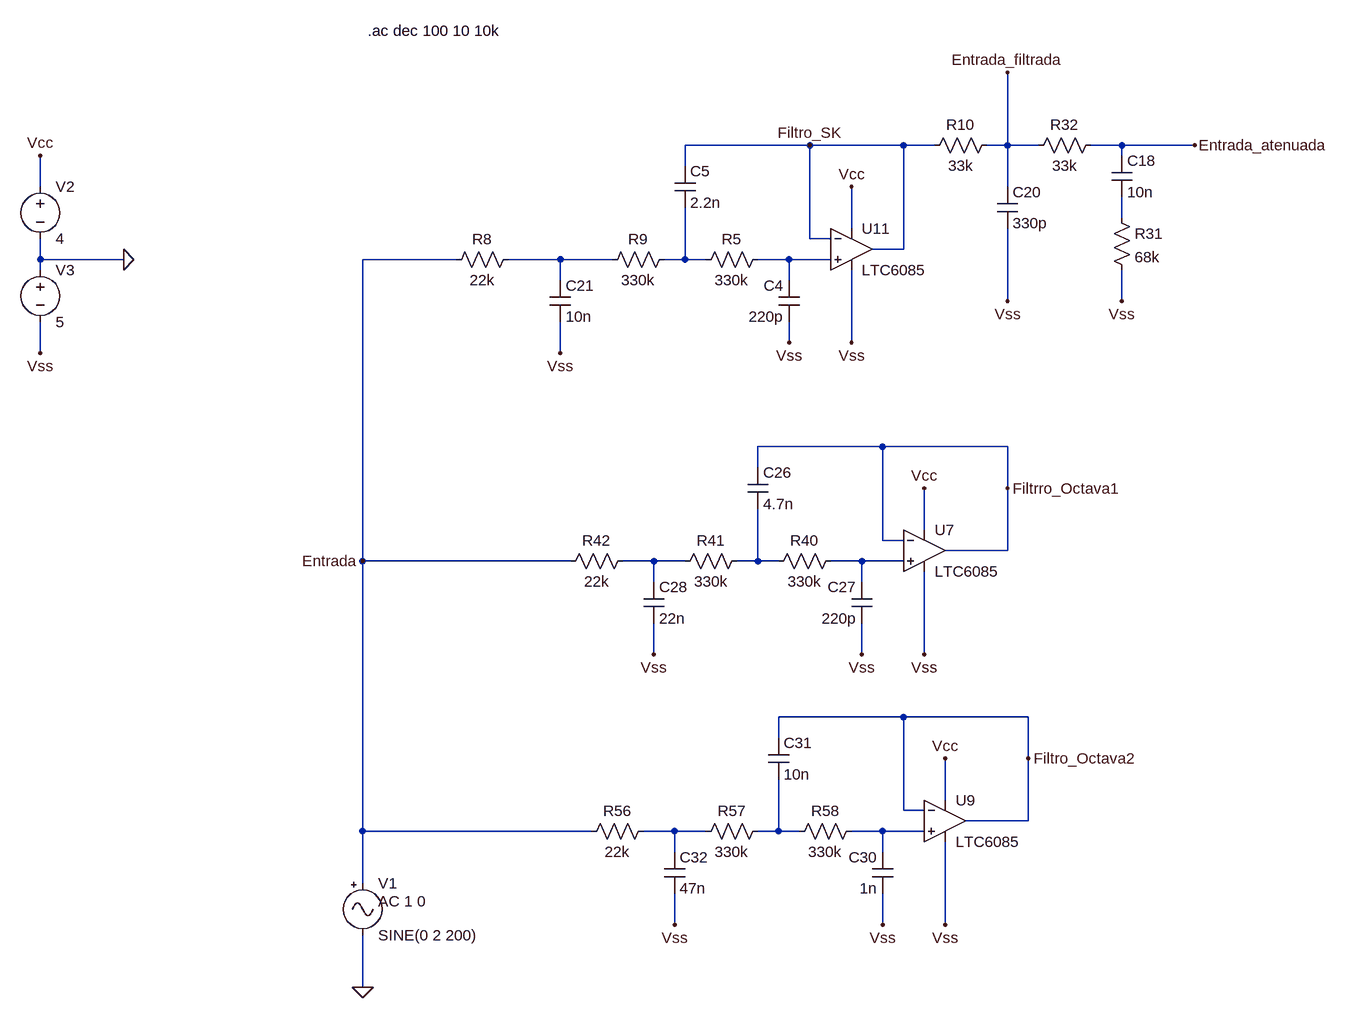
[diagram p0: schematic octavador OC2 - filtros.asc]
octavador OC2 - filtros.asc, the LTspice schematic file:
Version 4
SHEET 1 880 1368
WIRE -8992 -1648 -9184 -1648
WIRE -8848 -1648 -8992 -1648
WIRE -8800 -1648 -8848 -1648
WIRE -8688 -1648 -8688 -1760
WIRE -8688 -1648 -8720 -1648
WIRE -8640 -1648 -8688 -1648
WIRE -8512 -1648 -8560 -1648
WIRE -8400 -1648 -8512 -1648
WIRE -8512 -1632 -8512 -1648
WIRE -9184 -1616 -9184 -1648
WIRE -10176 -1584 -10176 -1632
WIRE -8688 -1584 -8688 -1648
WIRE -8512 -1536 -8512 -1568
WIRE -8928 -1520 -8928 -1584
WIRE -8992 -1504 -8992 -1648
WIRE -8960 -1504 -8992 -1504
WIRE -8848 -1488 -8848 -1648
WIRE -8848 -1488 -8896 -1488
WIRE -10176 -1472 -10176 -1504
WIRE -10048 -1472 -10176 -1472
WIRE -9536 -1472 -9680 -1472
WIRE -9376 -1472 -9456 -1472
WIRE -9296 -1472 -9376 -1472
WIRE -9184 -1472 -9184 -1552
WIRE -9184 -1472 -9216 -1472
WIRE -9152 -1472 -9184 -1472
WIRE -9024 -1472 -9072 -1472
WIRE -8960 -1472 -9024 -1472
WIRE -10176 -1456 -10176 -1472
WIRE -9376 -1440 -9376 -1472
WIRE -9024 -1440 -9024 -1472
WIRE -8688 -1408 -8688 -1520
WIRE -8512 -1408 -8512 -1456
WIRE -9024 -1344 -9024 -1376
WIRE -8928 -1344 -8928 -1456
WIRE -10176 -1328 -10176 -1376
WIRE -9376 -1328 -9376 -1376
WIRE -8880 -1184 -9072 -1184
WIRE -8688 -1184 -8880 -1184
WIRE -9072 -1152 -9072 -1184
WIRE -8688 -1120 -8688 -1184
WIRE -8816 -1056 -8816 -1120
WIRE -8880 -1040 -8880 -1184
WIRE -8848 -1040 -8880 -1040
WIRE -8688 -1024 -8688 -1120
WIRE -8688 -1024 -8784 -1024
WIRE -9680 -1008 -9680 -1472
WIRE -9360 -1008 -9680 -1008
WIRE -9232 -1008 -9280 -1008
WIRE -9184 -1008 -9232 -1008
WIRE -9072 -1008 -9072 -1088
WIRE -9072 -1008 -9104 -1008
WIRE -9040 -1008 -9072 -1008
WIRE -8912 -1008 -8960 -1008
WIRE -8848 -1008 -8912 -1008
WIRE -9232 -976 -9232 -1008
WIRE -8912 -976 -8912 -1008
WIRE -9232 -864 -9232 -912
WIRE -8912 -864 -8912 -912
WIRE -8816 -864 -8816 -992
WIRE -8848 -768 -9040 -768
WIRE -8656 -768 -8848 -768
WIRE -9040 -736 -9040 -768
WIRE -8656 -704 -8656 -768
WIRE -8784 -640 -8784 -704
WIRE -8848 -624 -8848 -768
WIRE -8816 -624 -8848 -624
WIRE -8656 -608 -8656 -704
WIRE -8656 -608 -8752 -608
WIRE -9680 -592 -9680 -1008
WIRE -9328 -592 -9680 -592
WIRE -9200 -592 -9248 -592
WIRE -9152 -592 -9200 -592
WIRE -9040 -592 -9040 -672
WIRE -9040 -592 -9072 -592
WIRE -9008 -592 -9040 -592
WIRE -8880 -592 -8928 -592
WIRE -8816 -592 -8880 -592
WIRE -9200 -560 -9200 -592
WIRE -8880 -560 -8880 -592
WIRE -9680 -512 -9680 -592
WIRE -9200 -448 -9200 -496
WIRE -8880 -448 -8880 -496
WIRE -8784 -448 -8784 -576
WIRE -9680 -352 -9680 -432
FLAG -10176 -1632 Vcc
FLAG -8816 -1120 Vcc
FLAG -8688 -1120 Filtrro_Octava1
FLAG -8784 -704 Vcc
FLAG -8656 -704 Filtro_Octava2
FLAG -8928 -1584 Vcc
FLAG -9680 -1008 Entrada
FLAG -10176 -1328 Vss
FLAG -10048 -1472 0
FLAG -9232 -864 Vss
FLAG -8912 -864 Vss
FLAG -8816 -864 Vss
FLAG -9200 -448 Vss
FLAG -8880 -448 Vss
FLAG -8784 -448 Vss
FLAG -8512 -1408 Vss
FLAG -8688 -1408 Vss
FLAG -9024 -1344 Vss
FLAG -8928 -1344 Vss
FLAG -9376 -1328 Vss
FLAG -9680 -352 0
FLAG -8400 -1648 Entrada_atenuada
FLAG -8992 -1648 Filtro_SK
FLAG -8688 -1760 Entrada_filtrada
SYMBOL Misc\\signal -9680 -528 R0
WINDOW 123 24 44 Left 2
WINDOW 39 0 0 Left 0
SYMATTR Value2 AC 1 0
SYMATTR InstName V1
SYMATTR Value SINE(0 2 200)
SYMBOL voltage -10176 -1600 R0
WINDOW 123 0 0 Left 0
WINDOW 39 0 0 Left 0
SYMATTR InstName V2
SYMATTR Value 4
SYMBOL voltage -10176 -1472 R0
WINDOW 123 0 0 Left 0
WINDOW 39 0 0 Left 0
SYMATTR InstName V3
SYMATTR Value 5
SYMBOL OpAmps\\LTC6085 -8816 -1024 R0
SYMATTR InstName U7
SYMBOL res -9376 -992 R270
WINDOW 0 32 56 VTop 2
WINDOW 3 0 56 VBottom 2
SYMATTR InstName R42
SYMATTR Value 22k
SYMBOL res -9200 -992 R270
WINDOW 0 32 56 VTop 2
WINDOW 3 0 56 VBottom 2
SYMATTR InstName R41
SYMATTR Value 330k
SYMBOL res -9056 -992 R270
WINDOW 0 32 56 VTop 2
WINDOW 3 0 56 VBottom 2
SYMATTR InstName R40
SYMATTR Value 330k
SYMBOL cap -9248 -976 R0
SYMATTR InstName C28
SYMATTR Value 22n
SYMBOL cap -9088 -1152 R0
SYMATTR InstName C26
SYMATTR Value 4.7n
SYMBOL cap -8896 -912 R180
WINDOW 0 24 56 Left 2
WINDOW 3 24 8 Left 2
SYMATTR InstName C27
SYMATTR Value 220p
SYMBOL OpAmps\\LTC6085 -8784 -608 R0
SYMATTR InstName U9
SYMBOL res -9344 -576 R270
WINDOW 0 32 56 VTop 2
WINDOW 3 0 56 VBottom 2
SYMATTR InstName R56
SYMATTR Value 22k
SYMBOL res -9168 -576 R270
WINDOW 0 32 56 VTop 2
WINDOW 3 0 56 VBottom 2
SYMATTR InstName R57
SYMATTR Value 330k
SYMBOL res -9024 -576 R270
WINDOW 0 32 56 VTop 2
WINDOW 3 0 56 VBottom 2
SYMATTR InstName R58
SYMATTR Value 330k
SYMBOL cap -9216 -560 R0
SYMATTR InstName C32
SYMATTR Value 47n
SYMBOL cap -9056 -736 R0
SYMATTR InstName C31
SYMATTR Value 10n
SYMBOL cap -8864 -496 R180
WINDOW 0 24 56 Left 2
WINDOW 3 24 8 Left 2
SYMATTR InstName C30
SYMATTR Value 1n
SYMBOL OpAmps\\LTC6085 -8928 -1488 R0
SYMATTR InstName U11
SYMBOL res -9552 -1456 R270
WINDOW 0 32 56 VTop 2
WINDOW 3 0 56 VBottom 2
SYMATTR InstName R8
SYMATTR Value 22k
SYMBOL res -9312 -1456 R270
WINDOW 0 32 56 VTop 2
WINDOW 3 0 56 VBottom 2
SYMATTR InstName R9
SYMATTR Value 330k
SYMBOL res -9168 -1456 R270
WINDOW 0 32 56 VTop 2
WINDOW 3 0 56 VBottom 2
SYMATTR InstName R5
SYMATTR Value 330k
SYMBOL cap -9392 -1440 R0
SYMATTR InstName C21
SYMATTR Value 10n
SYMBOL cap -9200 -1616 R0
SYMATTR InstName C5
SYMATTR Value 2.2n
SYMBOL cap -9008 -1376 R180
WINDOW 0 24 56 Left 2
WINDOW 3 24 8 Left 2
SYMATTR InstName C4
SYMATTR Value 220p
SYMBOL res -8816 -1632 R270
WINDOW 0 32 56 VTop 2
WINDOW 3 0 56 VBottom 2
SYMATTR InstName R10
SYMATTR Value 33k
SYMBOL res -8656 -1632 R270
WINDOW 0 32 56 VTop 2
WINDOW 3 0 56 VBottom 2
SYMATTR InstName R32
SYMATTR Value 33k
SYMBOL cap -8704 -1584 R0
SYMATTR InstName C20
SYMATTR Value 330p
SYMBOL cap -8528 -1632 R0
SYMATTR InstName C18
SYMATTR Value 10n
SYMBOL res -8528 -1552 R0
SYMATTR InstName R31
SYMATTR Value 68k
TEXT -9672 -1824 Left 2 !.ac dec 100 10 10k

The netlist it stands for:
* octavador OC2 - filtros.asc
V1 Entrada 0 SINE(0 2 200) AC 1 0
V2 Vcc 0 4
V3 0 Vss 5
* U7: LTC6085 (symbol OpAmps\LTC6085 not available, pins judged from their places): In+=N007 In-=Filtrro_Octava1 V+=Vcc V-=Vss OUT=Filtrro_Octava1
R42 Entrada N005 22k
R41 N005 N006 330k
R40 N006 N007 330k
C28 N005 Vss 22n
C26 Filtrro_Octava1 N006 4.7n
C27 Vss N007 220p
* U9: LTC6085 (symbol OpAmps\LTC6085 not available, pins judged from their places): In+=N010 In-=Filtro_Octava2 V+=Vcc V-=Vss OUT=Filtro_Octava2
R56 Entrada N008 22k
R57 N008 N009 330k
R58 N009 N010 330k
C32 N008 Vss 47n
C31 Filtro_Octava2 N009 10n
C30 Vss N010 1n
* U11: LTC6085 (symbol OpAmps\LTC6085 not available, pins judged from their places): In+=N004 In-=Filtro_SK V+=Vcc V-=Vss OUT=Filtro_SK
R8 Entrada N002 22k
R9 N002 N003 330k
R5 N003 N004 330k
C21 N002 Vss 10n
C5 Filtro_SK N003 2.2n
C4 Vss N004 220p
R10 Filtro_SK Entrada_filtrada 33k
R32 Entrada_filtrada Entrada_atenuada 33k
C20 Entrada_filtrada Vss 330p
C18 Entrada_atenuada N001 10n
R31 N001 Vss 68k
.ac dec 100 10 10k
.backanno
.end